# EAGLE design STATION_1608_v1 (EAGLE 9.4.2)
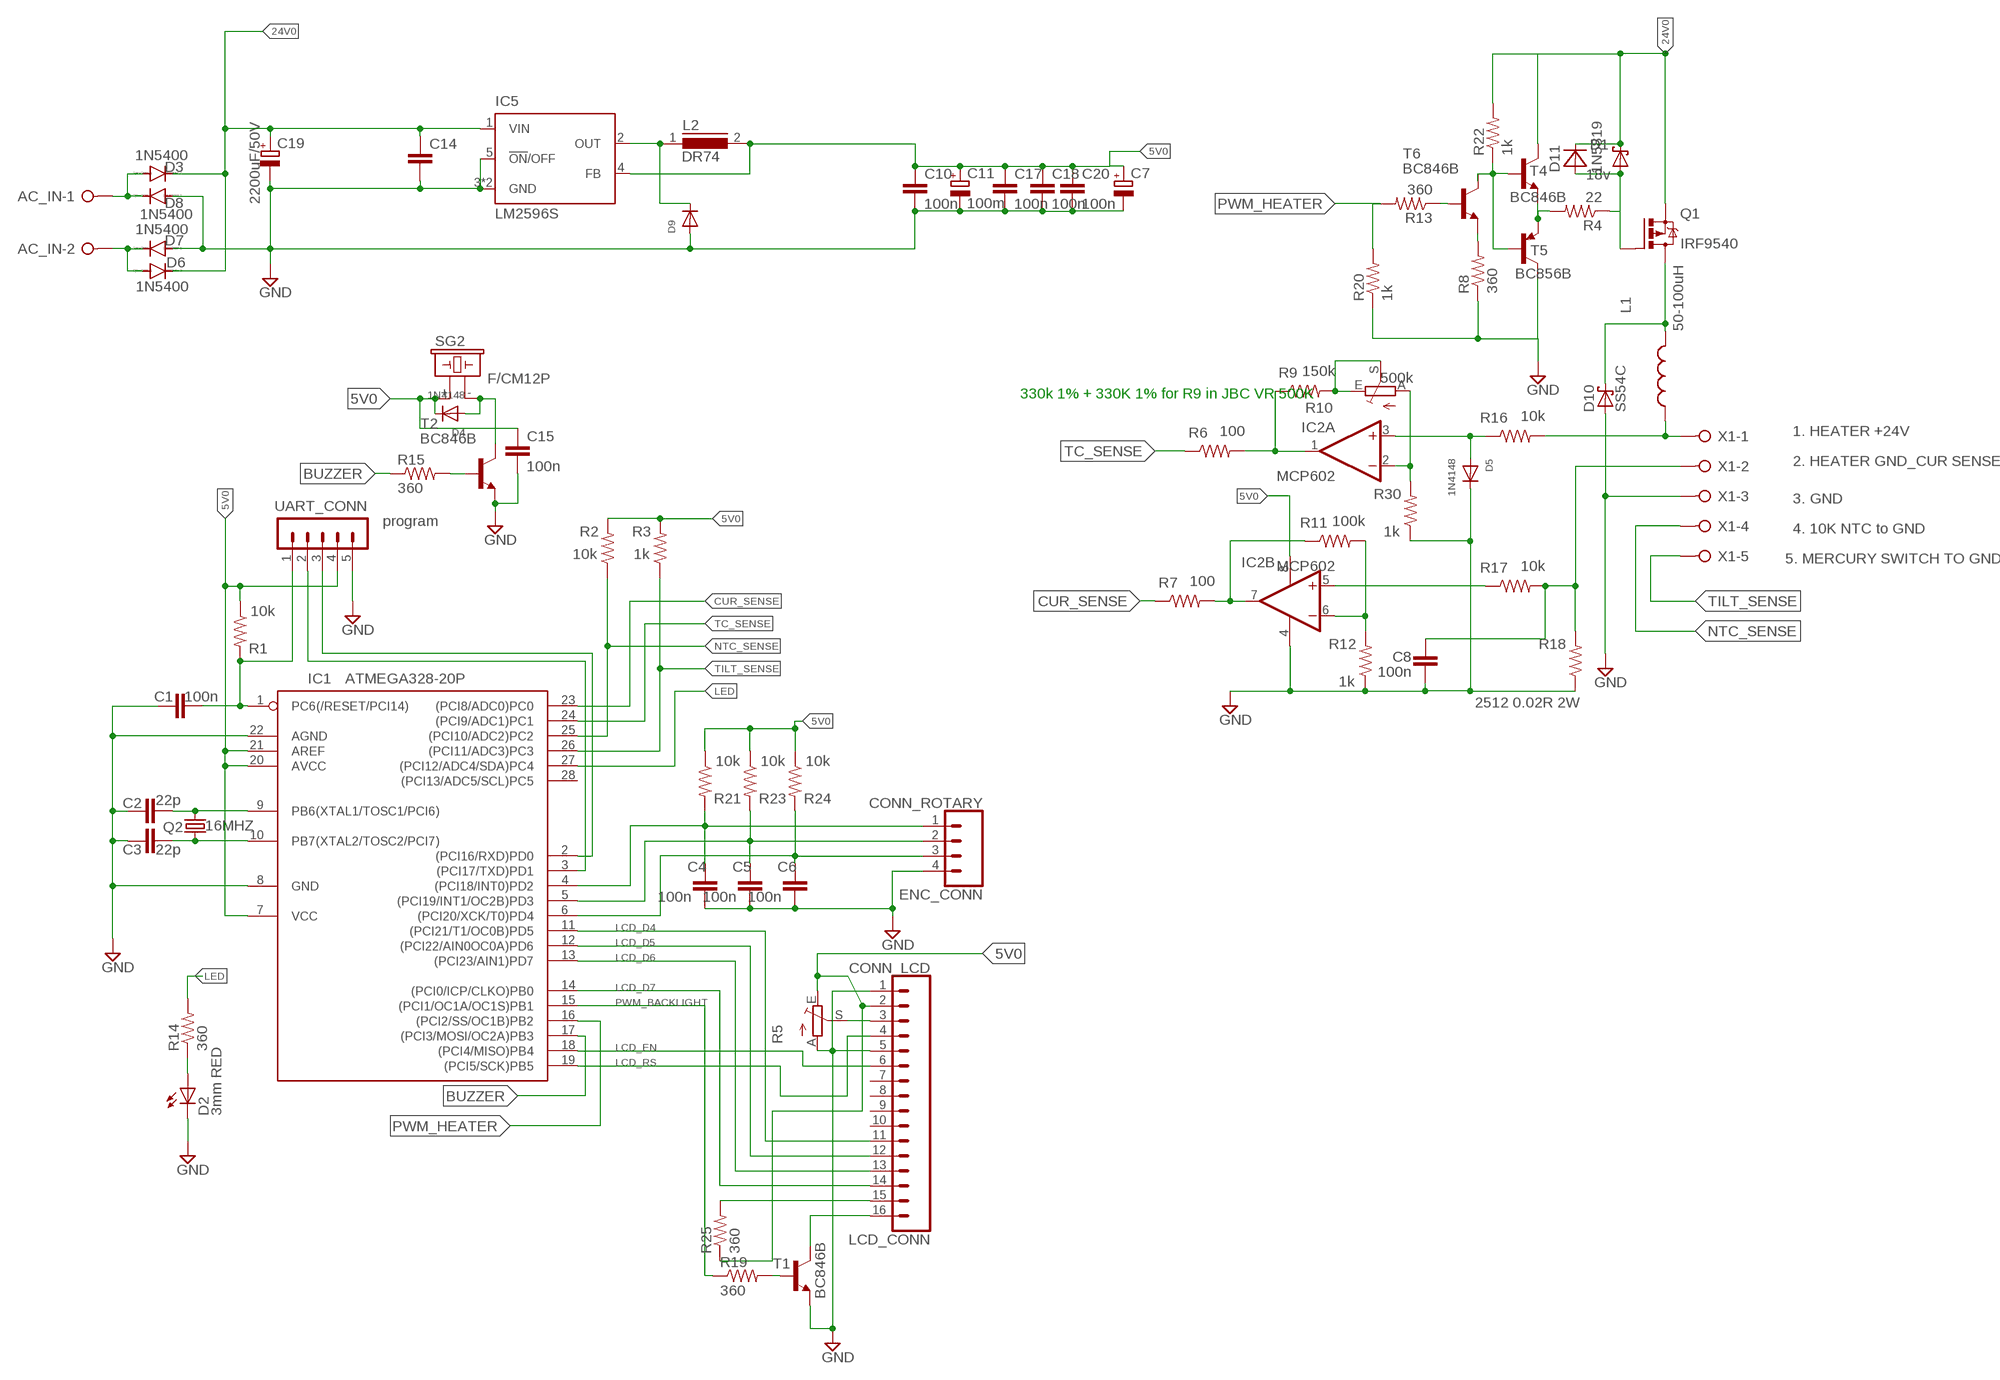
[diagram p0: schematic, sheet 1]

## Parts
AC_IN  W237-02P  [W237-132]
C1  100n  C-EUC0805  [C0805]
C2  22p  C-EUC0805  [C0805]
C3  22p  C-EUC0805  [C0805]
C4  100n  C-EUC0805  [C0805]
C5  100n  C-EUC0805  [C0805]
C6  100n  C-EUC0805  [C0805]
C7  CPOL-EUE3.5-8  [E3,5-8]
C8  100n  C-EUC0805  [C0805]
C10  100n  C-EUC0805  [C0805]
C11  100m  CPOL-EUE3.5-8  [E3,5-8]
C14  100n  C-EUC0805  [C0805]
C15  100n  C-EUC0805K  [C0805K]
C17  100n  C-EUC0805  [C0805]
C18  100n  C-EUC0805  [C0805]
C19  2200uF/50V  CPOL-EUE7.5-16  [E7,5-16]
C20  100n  C-EUC0805  [C0805]
D1  18v  BAS85  [SOD80C]
D2  3mm RED  LED5MM  [LED5MM]
D3  1N5400  [DO201-15]
D4  1N4148  DIODESOD-123  [SOD-123]
D5  1N4148  DIODESOD-123  [SOD-123]
D6  1N5400  [DO201-15]
D7  1N5400  [DO201-15]
D8  1N5400  [DO201-15]
D9  DIODESMA  [SMADIODE]
D10  SS54C  MBRS320T3  [SMC]
D11  1N5819  MBRA340T3  [SMA]
ENC_CONN  CONN_ROTARY  CONN_04LONGPADS  [1X04_LONGPADS]
IC1  ATMEGA328-20P  [DIL28-3]
IC2  MCP602  MCP602P  [DIL08]
IC5  LM2596S  [TO263-5]
L1  50-100uH  L-USIRF-46  [IRF46]
L2  DR74  [DR74]
LCD_CONN  CONN_LCD  CONN_16LONGPADS  [1X16_LONGPADS]
Q1  IRF9540  IRF4905FG  [TO220BV]
Q2  16MHZ  CRYSTALHC49S  [HC49/S]
R1  10k  R-US_M0805  [M0805]
R2  10k  R-US_M0805  [M0805]
R3  1k  R-US_M0805  [M0805]
R4  22  R-US_M0805  [M0805]
R5  TRIM_EU-RJ9W  [RJ9W]
R6  100  R-US_M0805  [M0805]
R7  100  R-US_M0805  [M0805]
R8  360  R-US_M0805  [M0805]
R9  150k  R-US_M0805  [M0805]
R10  500k  TRIM_EU-RJ9W  [RJ9W]
R11  100k  R-US_M0805  [M0805]
R12  1k  R-US_M0805  [M0805]
R13  360  R-US_M0805  [M0805]
R14  360  R-US_M0805  [M0805]
R15  360  R-US_M0805  [M0805]
R16  10k  R-US_M0805  [M0805]
R17  10k  R-US_M0805  [M0805]
R18  2512 0.02R 2W  R-US_R2512  [R2512]
R19  360  R-US_M0805  [M0805]
R20  1k  R-US_M0805  [M0805]
R21  10k  R-US_M0805  [M0805]
R22  1k  R-US_M0805  [M0805]
R23  10k  R-US_M0805  [M0805]
R24  10k  R-US_M0805  [M0805]
R25  360  R-US_M0805  [M0805]
R30  1k  R-US_M0805  [M0805]
SG2  F/CM12P  [F/CM12P]
T1  BC846B  BC846B-NPN-SOT23-BEC  [SOT23-BEC]
T2  BC846B  BC846B-NPN-SOT23-BEC  [SOT23-BEC]
T4  BC846B  BC846B-NPN-SOT23-BEC  [SOT23-BEC]
T5  BC856B  BC856B-PNP-SOT23-BEC  [SOT23-BEC]
T6  BC846B  BC846B-NPN-SOT23-BEC  [SOT23-BEC]
UART_CONN  program  MA05-1  [MA05-1]
X1  W237-05P  [W237-5P]

## Nets
5V0: C7.+ C10.1 C11.+ C15.1 C17.1 C18.1 C20.1 D4.C IC1.7(VCC) IC1.20(AVCC) IC1.21(AREF) IC2.8(P:V+) IC5.4(FB) L2.2 LCD_CONN.2 R1.1 R2.2 R3.2 R5.E R21.1 R23.1 R24.1 R25.1 SG2.+ UART_CONN.4
24V0: C14.1 C19.+ D1.1(K) D3.C D6.C D11.C IC5.1(VIN) Q1.S R22.2 T4.C
BUZZER: IC1.17((PCI3/MOSI/OC2A)PB3) R15.1
CUR_SENSE: IC1.23((PCI8/ADC0)PC0) R7.1
GND: C1.1 C2.1 C3.1 C4.2 C5.2 C6.2 C7.- C8.2 C10.2 C11.- C14.2 C15.2 C17.2 C18.2 C19.- C20.2 D2.K(C) D5.C D7.A D8.A D9.A D10.A ENC_CONN.4 IC1.8(GND) IC1.22(AGND) IC2.4(P:V-) IC5.3(GND) IC5.5(!ON!/OFF) IC5.6(GND) LCD_CONN.1 LCD_CONN.5 R5.A R8.1 R12.1 R18.1 R20.1 R30.1 T1.E T2.E T5.C UART_CONN.5 X1.3
LCD_D4: IC1.11((PCI21/T1/OC0B)PD5) LCD_CONN.11
LCD_D5: IC1.12((PCI22/AIN0OC0A)PD6) LCD_CONN.12
LCD_D6: IC1.13((PCI23/AIN1)PD7) LCD_CONN.13
LCD_D7: IC1.14((PCI0/ICP/CLKO)PB0) LCD_CONN.14
LCD_EN: IC1.18((PCI4/MISO)PB4) LCD_CONN.6
LCD_RS: IC1.19((PCI5/SCK)PB5) LCD_CONN.4
LED: IC1.27((PCI12/ADC4/SDA)PC4) R14.2
MOSFET_GATE: D1.2(A) D11.A Q1.G R4.1
N$1: C2.2 IC1.9(PB6(XTAL1/TOSC1/PCI6)) Q2.2
N$2: C3.2 IC1.10(PB7(XTAL2/TOSC2/PCI7)) Q2.1
N$3: C4.1 ENC_CONN.1 IC1.4((PCI18/INT0)PD2) R21.2
N$4: R4.2 T4.E T5.E
N$5: C5.1 ENC_CONN.2 IC1.5((PCI19/INT1/OC2B)PD3) R23.2
N$6: D9.C IC5.2(OUT) L2.1
N$7: IC1.3((PCI17/TXD)PD1) UART_CONN.2
N$8: IC1.2((PCI16/RXD)PD0) UART_CONN.3
N$9: C6.1 ENC_CONN.3 IC1.6((PCI20/XCK/T0)PD4) R24.2
N$10: AC_IN.2 D6.A D7.C
N$11: AC_IN.1 D3.A D8.C
N$12: LCD_CONN.3 R5.S
N$14: LCD_CONN.16 T1.C
N$15: LCD_CONN.15 R25.2
N$16: R15.2 T2.B
N$18: IC2.7(B:OUT) R7.2 R11.1
N$19: R13.1 T6.B
N$20: IC2.6(B:-IN) R11.2 R12.2
N$22: R22.1 T4.B T5.B T6.C
N$23: IC2.5(B:+IN) R17.1
N$25: R9.2 R10.E R10.S
N$26: IC2.2(A:-IN) R10.A R30.2
N$27: IC2.1(A:OUT) R6.2 R9.1
N$28: D5.A IC2.3(A:+IN) R16.1
N$29: R8.2 T6.E
N$30: C1.2 IC1.1(PC6(/RESET/PCI14)) R1.2 UART_CONN.1
N$31: L1.1 R16.2 X1.1
N$32: D10.C L1.2 Q1.D
N$34: D4.A SG2.- T2.C
N$35: R19.2 T1.B
N$37: D2.A R14.1
N$40: C8.1 R17.2 R18.2 X1.2
NTC_SENSE: IC1.25((PCI10/ADC2)PC2) R2.1 X1.4
PWM_BACKLIGHT: IC1.15((PCI1/OC1A/OC1S)PB1) R19.1
PWM_HEATER: IC1.16((PCI2/SS/OC1B)PB2) R13.2 R20.2
TC_SENSE: IC1.24((PCI9/ADC1)PC1) R6.1
TILT_SENSE: IC1.26((PCI11/ADC3)PC3) R3.1 X1.5
Unconnected: IC1.28((PCI13/ADC5/SCL)PC5) LCD_CONN.7 LCD_CONN.8 LCD_CONN.9 LCD_CONN.10

## Notes on the sheet
- 330k 1% + 330K 1% for R9 in JBC VR 500K
- 1. HEATER +24V
- 2. HEATER GND_CUR SENSE
- 3. GND
- 4. 10K NTC to GND
- 5. MERCURY SWITCH TO GND

## Library data of the parts
AC_IN = con-wago-508:W237-02P: WAGO SREW CLAMP; OC_FARNELL: unknown; OC_NEWARK: unknown
C1-C6 C8 C15 = rcl:C-EU: CAPACITOR, European symbol; SPICEPREFIX: C
C7 C11 C19 = rcl:CPOL-EU: POLARIZED CAPACITOR, European symbol; SPICEPREFIX: C
C10 C14 C17 C18 C20 = resistor:C-EU: CAPACITOR, European symbol; COMET: 16789
D1 = nxp_60:BAS85: Schottky barrier diode Planar Schottky barrier diode with an integrated guard ring for stress protection, encapsulated in a small hermetically sealed glass SOD80C Surface-Mounted Device SMD package with tin-plated metal discs at each end. It is suitable for ?automatic placement? and as such it can withstand immersion soldering. AAL Eindhoven MK
D2 = adafruit:LED: LED OSRAM: - CHIPLED LG R971, LG N971, LY N971, LG Q971, LY Q971, LO R971, LY R971 LH N974, LH R974 LS Q976, LO Q976, LY Q976 LO Q996 - Hyper CHIPLED LW Q18S LB Q993, LB Q99A, LB R99A - SideLED LS A670, LO A670, LY A670, LG A670, LP A670 LB A673, LV A673, LT A673, LW A673 LH A674 LY A675 LS A676, LA A676, LO A676, LY A676, LW A676 LS A679, LY A679, LG A679 - Hyper Micro SIDELED® LS Y876, LA Y876, LO Y876, LY Y876 LT Y87S - SmartLED LW L88C, LW L88S LB L89C, LB L89S, LG L890 LS L89K, LO L89K, LY L89K LS L896, LA L896, LO L896, LY L896 - TOPLED LS T670, LO T670, LY T670, LG T670, LP T670 LSG T670, LSP T670, LSY T670, LOP T670, LYG T670 LG T671, LOG T671, LSG T671 LB T673, LV T673, LT T673, LW T673 LH T674 LS T676, LA T676, LO T676, LY T676, LB T676, LH T676, LSB T676, LW T676 LB T67C, LV T67C, LT T67C, LS T67K, LO T67K, LY T67K, LW E67C LS E67B, LA E67B, LO E67B, LY E67B, LB E67C, LV E67C, LT E67C LW T67C LS T679, LY T679, LG T679 LS T770, LO T770, LY T770, LG T770, LP T770 LB T773, LV T773, LT T773, LW T773 LH T774 LS E675, LA E675, LY E675, LS T675 LS T776, LA T776, LO T776, LY T776, LB T776 LHGB T686 LT T68C, LB T68C - Hyper Mini TOPLED® LB M676 - Mini TOPLED Santana® LG M470 LS M47K, LO M47K, LY M47K Source: http://www.osram.convergy.de/
D3 D6-D8 = diode:1N5400: DIODE standard rectifier, 3 A, 50 V (Motorola)
D4 D5 D9 = adafruit:DIODE: Diode SMADIODE - SMA Surface Mount Package 20V 1A Schottky Diode Digikey: 641-1014-6-ND DO-1N4148 - Through Hole Small Current Diode SOD-123 20V 1 A (.5mV Vf) Schottky Diode - Digikey: MBRX120TPMSCT-ND SOD-323 10V 570mA (.38mV Vf, 3ns) Schottky Diode - Digikey: ZLLS410CT-ND SOD-523 30V 30mA Schottky Diode (RB751S-40TE61) - Digikey: RB751S-40TE61CT-ND SOT23-R/W - SOT23 Package (R = Solder Paste/Reflow Ovens, W = Hand-Soldering) BAT54Film 40V 300mA - Digikey: 497-7162-1-ND
D10 = diode:MBRS3*0T3: SCHOTTKY BARRIER RECTIFIER 3.0 AMPERES 20, 30, 40 VOLT Source: MBRS340T3-D.pdf
D11 = diode:MBRA340T3: Surface Mount Schottky Power Rectifier Source: http://www.onsemi.com/pub_link/Collateral/MBRA340T3-D.PDF
ENC_CONN = SparkFun-Connectors:CONN_04: Multi connection point. Often used as Generic Header-pin footprint for 0.1 inch spaced/style header connections On any of the 0.1 inch spaced packages, you can populate with these: Break Away Headers - Straight <https://www.sparkfun.com/products/116> (PRT-00116) Break Away Male Headers - Right Angle <https://www.sparkfun.com/products/553> (PRT-00553) Female Headers <https://www.sparkfun.com/products/115> (PRT-00115) Break Away Headers - Machine Pin <https://www.sparkfun.com/products/117> (PRT-00117) Break Away Female Headers - Swiss Machine Pin <https://www.sparkfun.com/products/743> (PRT-00743) For SCREWTERMINALS and SPRING TERMINALS visit here: Screw Terimnals on SparkFun.com <https://www.sparkfun.com/search/results?term=Screw+Terminals> (5mm/3.5mm/2.54mm spacing) This device is also useful as a general connection point to wire up your design to another part of your project. Our various solder wires solder well into these plated through hole pads. Hook-Up Wire - Assortment (Stranded, 22 AWG) <https://www.sparkfun.com/products/11375> (PRT-11375) Hook-Up Wire - Assortment (Solid Core, 22 AWG) <https://www.sparkfun.com/products/11367> (PRT-11367) View the entire wire category on our website here <https://www.sparkfun.com/categories/141> Special notes: Molex polarized connector foot print use with SKU : PRT-08231 with associated crimp pins and housings. 1MM SMD Version SKU: PRT-10208; PROD_ID: CONN-09696
IC1 = atmega328:ATMEGA328*P: MICROCONTROLLER 32 kBytes FLASH 2 kBytes SRAM 1 kBytes EEPROM USART 8-channel 10 bit ADC
IC2 = linear:MCP602: Single Op Amp 2.7V to 6.0V Single Supply CMOS Source: http://ww1.microchip.com/downloads/en/DeviceDoc/21314g.pdf
IC5 = national-semiconductor:LM2596: SIMPLE SWITCHER® Power Converter 150 kHz 3A Step-Down Voltage Regulator Source: http://www.national.com/ds/LM/LM2596.pdf; MF: NATIONAL SEMICONDUCTOR; MPN: LM2596S-ADJ/NOPB; OC_FARNELL: 9494367; OC_NEWARK: 41K3842
L1 = rcl:L-US: INDUCTOR, American symbol; SPICEPREFIX: L
L2 = inductors:DR74: High Power Density, High Efficiency, Shielded Inductors Source: coiltronics_dr_series.pdf; COMET: 45279; SPICEPREFIX: L
LCD_CONN = SparkFun-Connectors:CONN_16: Multi connection point. Often used as Generic Header-pin footprint for 0.1 inch spaced/style header connections On any of the 0.1 inch spaced packages, you can populate with these: Break Away Headers - Straight <https://www.sparkfun.com/products/116> (PRT-00116) Break Away Male Headers - Right Angle <https://www.sparkfun.com/products/553> (PRT-00553) Female Headers <https://www.sparkfun.com/products/115> (PRT-00115) Break Away Headers - Machine Pin <https://www.sparkfun.com/products/117> (PRT-00117) Break Away Female Headers - Swiss Machine Pin <https://www.sparkfun.com/products/743> (PRT-00743) For SCREWTERMINALS and SPRING TERMINALS visit here: Screw Terimnals on SparkFun.com <https://www.sparkfun.com/search/results?term=Screw+Terminals> (5mm/3.5mm/2.54mm spacing) This device is also useful as a general connection point to wire up your design to another part of your project. Our various solder wires solder well into these plated through hole pads. Hook-Up Wire - Assortment (Stranded, 22 AWG) <https://www.sparkfun.com/products/11375> (PRT-11375) Hook-Up Wire - Assortment (Solid Core, 22 AWG) <https://www.sparkfun.com/products/11367> (PRT-11367) View the entire wire category on our website here <https://www.sparkfun.com/categories/141> Special notes: Molex polarized connector foot print use with SKU : PRT-08231 with associated crimp pins and housings. 1MM SMD Version SKU: PRT-10208 NOTES ON THE VARIANTS LOCK and LOCK_LONGPADS... This footprint was designed to help hold the alignment of a through-hole component (i.e. 6-pin header) while soldering it into place. You may notice that each hole has been shifted either up or down by 0.005 of an inch from it's more standard position (which is a perfectly straight line). This slight alteration caused the pins (the squares in the middle) to touch the edges of the holes. Because they are alternating, it causes a "brace" to hold the component in place. 0.005 has proven to be the perfect amount of "off-center" position when using our standard breakaway headers. Although looks a little odd when you look at the bare footprint, once you have a header in there, the alteration is very hard to notice. Also,if you push a header all the way into place, it is covered up entirely on the bottom side.
Q1 = transistor-power:IRF4905: P-Channel HEXFET® Power MOSFET RDS(on)= 0.02 Ohm, ID = -74A Source: http://www.irf.com/product-info/datasheets/data/irf4905pbf.pdf
Q2 = crystal:CRYSTAL: CRYSTAL; OC_FARNELL: 1667008; OC_NEWARK: unknown
R1-R4 R6-R9 R11-R17 R19-R25 R30 = rcl:R-US_: RESISTOR, American symbol; SPICEPREFIX: R
R5 R10 = pot:TRIM_EU-: POTENTIOMETER
R18 = rcl:R-US_: RESISTOR, American symbol; COMET: 35370; SPICEPREFIX: R
SG2 = buzzer:F/CM12P: BUZZER Source: Buerklin; OC_FARNELL: unknown; OC_NEWARK: unknown
T1 T2 T4 T6 = transistor:*-NPN-: NPN Transistror BF959 corrected 2008.03.06
T5 = transistor:*-PNP-: PNP Transistror
UART_CONN = con-lstb:MA05-1: PIN HEADER; OC_FARNELL: unknown; OC_NEWARK: unknown
X1 = con-wago-508:W237-05P: WAGO SREW CLAMP; OC_FARNELL: unknown; OC_NEWARK: unknown

## Board
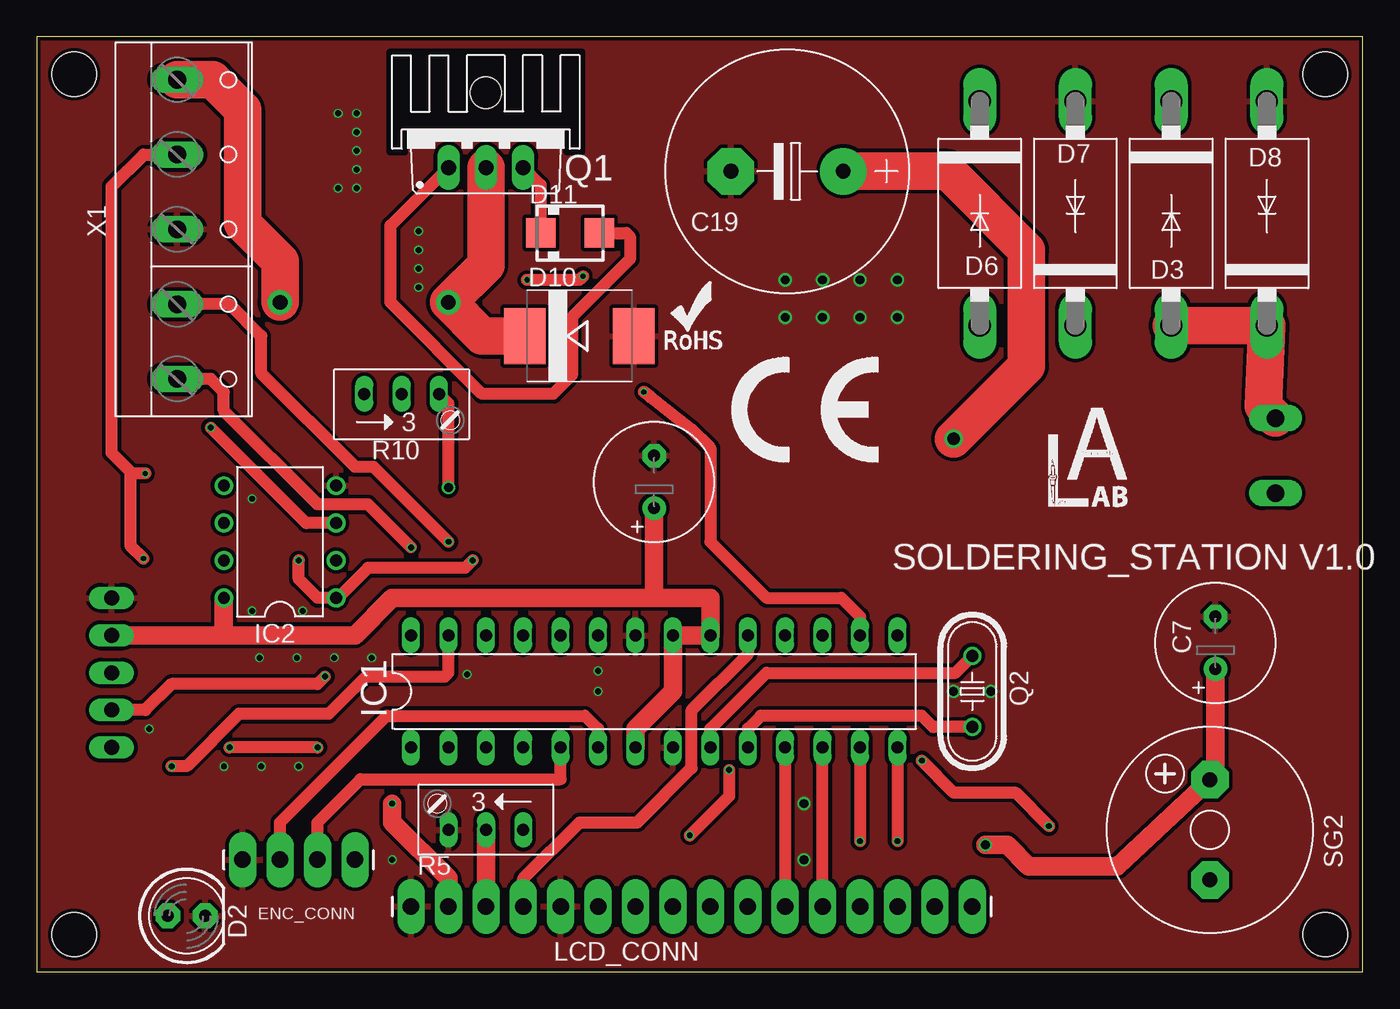
[diagram p1: board, top side]
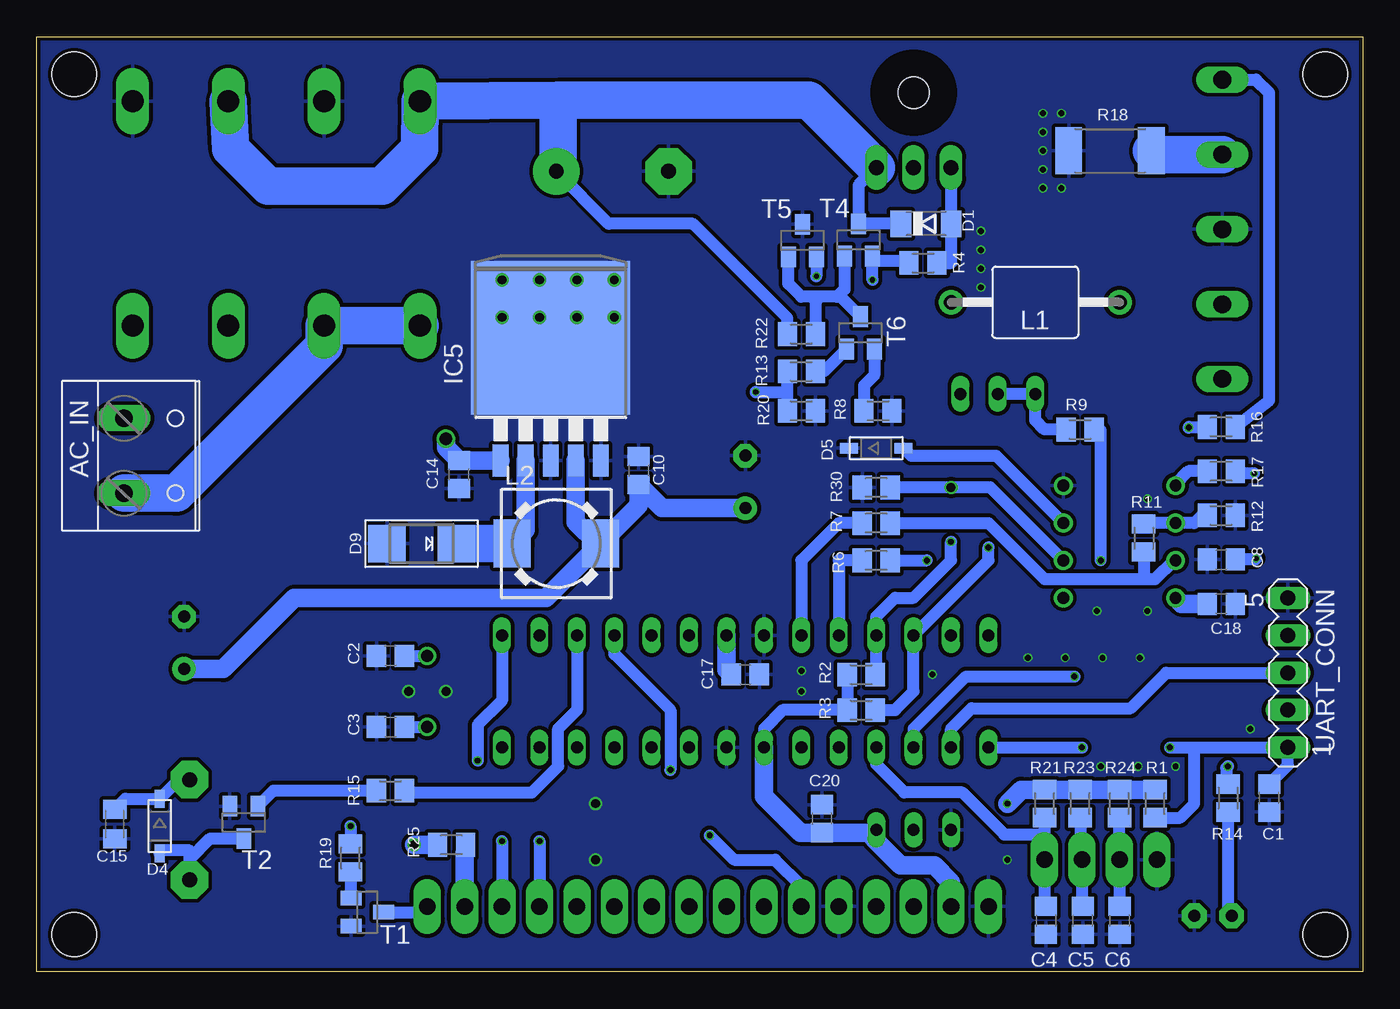
[diagram p2: board, bottom side, seen from below]

Size 90 x 63.49 mm. Coordinates in mm from the lower left corner, seen from the top.
Outline: 0,0 90,0 90,63.49 0,63.49 0,0
Copper layers (1*16): Top 0.035559375mm / dielectric 1.6mm / Bottom 0.035559375mm
Design rules "jlcpcb2layer": minimum track width 5mil, minimum drill 12mil, track to track 5mil, track to pad 5mil, pad to pad 5mil, via to via 5mil, smd to smd 5mil, copper to edge 8mil, drill to drill 6mil, minimum pad ring 5mil, minimum via ring 3mil, stop-mask expansion 2.5mil, vias tented up to drill 0mil, thermal gap 10mil
Holes 3 mm at 2.54,2.54 87.46,2.54 2.54,60.95 87.46,60.95

### Footprints (pad centres in the part's own frame; a part is rotated, then mirrored left to right if it is on the bottom)
W237-132 = drill 1.194 long: 1 -2.54,-0.635; 2 2.54,-0.635
C0805 = smd 1.3 x 1.5: 1 -0.95,0; 2 0.95,0
E3,5-8 = drill 0.813 pad 1.6: + -1.778,0 | drill 0.813 pad 1.6 octagon: - 1.778,0
C0805K = smd 1.3 x 1.6: 1 -1,0; 2 1,0
E7,5-16 = drill 1.016 pad 3.15: + -3.81,0 | drill 1.016 pad 3.15 octagon: - 3.81,0
SOD80C = smd 1.4 x 1.8: 1 -1.7,0; 2 1.7,0
LED5MM = drill 0.813 pad 1.676 octagon: A -1.27,0; K 1.27,0
DO201-15 = drill 1.499 long: A 7.62,0; C -7.62,0
SOD-123 = smd 1.2 x 0.7: A 1.85,0; C -1.85,0
SMADIODE = smd 2.54 x 2.54: A 2.349,0; C -2.349,0
SMC = smd 2.8 x 3.8: A 3.7,0; C -3.7,0
SMA = smd 2 x 2: A 2,0; C -2,0
1X04_LONGPADS = drill 1.118 pad 1.88 long: 1 0,0; 2 2.54,0; 3 5.08,0; 4 7.62,0
DIL28-3 = drill 0.813 long: 1 -16.51,-3.81; 2 -13.97,-3.81; 3 -11.43,-3.81; 4 -8.89,-3.81; 5 -6.35,-3.81; 6 -3.81,-3.81; 7 -1.27,-3.81; 8 1.27,-3.81; 9 3.81,-3.81; 10 6.35,-3.81; 11 8.89,-3.81; 12 11.43,-3.81; 13 13.97,-3.81; 14 16.51,-3.81; 15 16.51,3.81; 16 13.97,3.81; 17 11.43,3.81; 18 8.89,3.81; 19 6.35,3.81; 20 3.81,3.81; 21 1.27,3.81; 22 -1.27,3.81; 23 -3.81,3.81; 24 -6.35,3.81; 25 -8.89,3.81; 26 -11.43,3.81; 27 -13.97,3.81; 28 -16.51,3.81
DIL08 = drill 0.813 pad 1.27: 1 -3.81,-3.81; 2 -1.27,-3.81; 3 1.27,-3.81; 4 3.81,-3.81; 5 3.81,3.81; 6 1.27,3.81; 7 -1.27,3.81; 8 -3.81,3.81
TO263-5 = smd 1.067 x 2.159: 1 -3.404,-5.791; 2 -1.702,-5.791; 3 0,-5.791; 4 1.702,-5.791; 5 3.404,-5.791 | smd 10.8 x 10.41: 6 0,2.54
IRF46 = drill 1 pad 1.676: 1 -5.715,0; 2 5.715,0
DR74 = smd 2.5 x 3.25: 1 -3,0; 2 3,0
1X16_LONGPADS = drill 1.118 pad 1.88 long: 1 0,0; 2 2.54,0; 3 5.08,0; 4 7.62,0; 5 10.16,0; 6 12.7,0; 7 15.24,0; 8 17.78,0; 9 20.32,0; 10 22.86,0; 11 25.4,0; 12 27.94,0; 13 30.48,0; 14 33.02,0; 15 35.56,0; 16 38.1,0
TO220BV = drill 1.016 long: D 0,-2.54; G -2.54,-2.54; S 2.54,-2.54
HC49/S = drill 0.813: 1 -2.413,0; 2 2.413,0
M0805 = smd 1.3 x 1.6: 1 -0.95,0; 2 0.95,0
RJ9W = drill 0.813 long: A 2.54,0.635; E -2.54,0.635; S 0,0.635
R2512 = smd 1.8 x 3.2: 1 -2.8,0; 2 2.8,0
F/CM12P = drill 1.016 pad 2.54 octagon: + 3.4,0; - -3.4,0
SOT23-BEC = smd 1 x 1.4: B -0.95,-1.1; C 0,1.1; E 0.95,-1.1
SK-95 = hole 2.134: 0,0
MA05-1 = drill 1.016 long: 1 -5.08,0; 2 -2.54,0; 3 0,0; 4 2.54,0; 5 5.08,0
W237-5P = drill 1.194 long: 1 -10.16,-0.635; 2 -5.08,-0.635; 3 0,-0.635; 4 5.08,-0.635; 5 10.16,-0.635

### Placement (x,y rotation side)
AC_IN  83.44,35.05 270 bottom
C1  6.35,11.81 90 bottom
C2  66,21.46 0 bottom
C3  66,16.64 0 bottom
C4  21.5,3.5 270 bottom
C5  19,3.5 270 bottom
C6  16.5,3.5 270 bottom
C7  80.01,22.35 90 top
C8  9.6,28 180 bottom
C10  49.15,34.04 90 bottom
C11  41.91,33.27 90 top
C14  61.34,33.78 270 bottom
C15  84.71,10.03 270 bottom
C17  41.91,20.19 0 bottom
C18  9.6,25 0 bottom
C19  50.93,54.36 180 top
C20  36.7,10.41 90 bottom
D1  29.64,50.8 0 bottom
D2  10.16,3.81 0 top
D3  77,51.5 270 top
D4  81.66,9.91 270 bottom
D5  33.02,35.56 0 bottom
D6  64,51.5 270 top
D7  70.5,51.5 90 top
D8  83.5,51.5 90 top
D9  63.88,29.08 180 bottom
D10  36.83,43.18 0 top
D11  36.2,50.16 0 top
ENC_CONN  21.59,7.62 180 top
IC1  41.91,19.05 0 top
IC2  16.51,29.21 90 top
IC5  55.12,40.51 0 bottom
L1  22.23,45.47 180 bottom
L2  54.74,29.08 0 bottom
LCD_CONN  25.4,4.45 0 top
Q1  30.48,57.15 0 top
Q2  63.5,19.05 90 top
R1  14.1,11.43 270 bottom
R2  34.04,20.19 180 bottom
R3  34.04,17.78 180 bottom
R4  29.84,48.13 180 bottom
R5  30.48,10.29 180 top
R6  33.02,27.94 0 bottom
R7  33.02,30.48 0 bottom
R8  32.89,38.1 180 bottom
R9  19.18,36.83 180 bottom
R10  24.77,38.61 0 top
R11  14.86,29.46 90 bottom
R12  9.6,31 180 bottom
R13  38.1,40.77 180 bottom
R14  9.14,11.81 90 bottom
R15  66,12.32 180 bottom
R16  9.6,37 0 bottom
R17  9.6,34 0 bottom
R18  2512 0.15R HAKKO 0.002 JBC  [R2512]  17.14,55.75 0 bottom
R19  68.71,7.75 270 bottom
R20  38.1,38.1 180 bottom
R21  21.59,11.43 270 bottom
R22  38.1,43.31 180 bottom
R23  19.18,11.43 270 bottom
R24  16.51,11.43 270 bottom
R25  61.85,8.64 0 bottom
R30  33.02,32.89 0 bottom
SG2  79.63,9.65 90 top
T1  67.56,4.06 270 bottom
T2  75.95,10.16 180 bottom
T4  34.22,49.7 0 bottom
T5  38.03,49.66 0 bottom
T6  34.1,43.4 0 bottom
U$1  [SK-95]  30.48,59.69 0 top
U$2  [ALAB_LOGO]  71.12,34.29 0 top
U$3  [ROHS_LOGO_0.18_IN]  42.42,42.16 0 top
U$4  [CE_7.3MM]  47.12,34.54 0 top
UART_CONN  5.08,20.32 90 bottom
X1  10.16,50.42 270 top

### Tracks (layer width: path | path; a pad name or v marks a point on that pad's centre or on a via)
5V0  (via drill 0.4, 0.6)
  Top 1.27: v24.13,11.43 24.13,10.16 27.94,6.35 LCD_CONN.2 | 41.91,25.4 45.72,25.4 IC1.20 IC1.21 43.18,19.05 40.64,16.51 IC1.7 | 41.91,25.4 24.13,25.4 21.59,22.86 12.7,22.86 | 12.7,22.86 UART_CONN.4 | IC2.8 12.7,22.86 | C11.+ 41.91,25.4 | v64.39,8.64 65.88,8.64 67.32,7.19 73.36,7.19 SG2.+ 80.01,13.84 C7.+
  Bottom 0.813: R2.2 R3.2 39.37,17.78 40.64,16.51 IC1.7 | SG2.+ 79.95,13.46 D4.C 83.99,11.76 C15.1
  Bottom 1.27: LCD_CONN.2 27.94,6.1 29.08,7.24 31.37,7.24 33.21,9.08 33.21,9.46 | v24.13,11.43 23.18,12.38 R21.1 R23.1 R24.1 R1.1 | IC2.8 12.3,25 C18.1 | IC1.7 40.64,11.94 38.17,9.46 C20.1 33.21,9.46 | 33.21,9.46 R5.E | L2.2 49.15,31.67 C10.1 47.56,31.5 C11.+ | IC5.4 53.42,30.56 51.94,29.08 L2.2 | C17.1 43.18,20.51 IC1.21 | R25.1 v64.39,8.64 | L2.2 55.42,25.4 72.52,25.4 77.34,20.57 C7.+
24V0  (via drill 0.85)
  Top 0.813: Q1.S 34.2,53.44 D11.C
  Top 2.54: v62.23,36.2 67.18,41.15 67.18,49.02 61.85,54.36 C19.+
  Bottom 0.813: D1.1 T4.C 34.22,53.41 Q1.S | R22.2 39.05,44.38 45.47,50.8 51.18,50.8 C19.+
  Bottom 1.27: IC5.1 C14.1 62.23,35.62 v62.23,36.2
  Bottom 2.54: D3.C 76.83,55.88 74.3,53.34 66.55,53.34 64.01,55.88 D6.C 54.61,59.18 | Q1.S 37.59,59.18 54.61,59.18 | C19.+ 54.61,54.48 54.61,59.18
BUZZER
  Bottom 0.813: IC1.17 53.34,17.78 54.61,16.51 54.61,13.97 56.39,12.19 65.09,12.19 R15.1
CUR_SENSE
  Bottom 0.813: R7.1 35.56,30.48 38.1,27.94 IC1.23
GND  (via drill 0.4, 0.6)
  other vias: 14.61,24.51 18.03,24.51 24.13,7.62 38.1,20.45 29.21,20.19 38.1,19.05 7.62,16.51 20.19,21.34 22.73,21.34 17.65,21.34 15.11,21.34 17.78,13.97 15.24,13.97 12.7,13.97 50.8,46.99 58.42,46.99 58.42,44.45 55.88,44.45 55.88,46.99 53.34,46.99 53.34,44.45 50.8,44.45 20.45,58.29 21.72,58.29 21.72,57.02 21.72,55.75 21.72,54.48 21.72,53.21 20.45,53.21 14.61,32.13 52.07,11.43 52.07,7.62 64.77,19.05 62.23,19.05 25.91,50.29 25.91,49.02 25.91,47.75 25.91,46.48
  pour Bottom (isolate 0.254): -11.43,-2.54 -11.43,67.31 100.33,67.31 100.33,-2.54
  pour Top (isolate 0.254): -6.35,-3.81 -6.35,67.31 96.52,67.31 96.52,-3.81
  pour Bottom (no thermals): 48.26,49.53 62.23,49.53 62.23,38.1 60.96,36.83 48.26,36.83
LCD_D4
  Top 0.813: IC1.11 LCD_CONN.11
LCD_D5
  Top 0.813: LCD_CONN.12 IC1.12
LCD_D6  (via drill 0.4)
  Top 0.813: IC1.13 v55.88,8.89
  Bottom 0.813: v55.88,8.89 LCD_CONN.13
LCD_D7  (via drill 0.4)
  Top 0.813: IC1.14 v58.42,8.89
  Bottom 0.813: v58.42,8.89 LCD_CONN.14
LCD_EN  (via drill 0.4)
  Top 0.813: v44.32,9.27 46.99,11.94 v46.99,13.72
  Bottom 0.813: v46.99,13.72 46.99,17.78 50.8,21.59 IC1.18 | v44.32,9.27 42.67,7.62 39.88,7.62 38.1,5.84 LCD_CONN.6
LCD_RS
  Top 0.813: IC1.19 48.26,21.59 44.45,17.78 44.45,13.84 40.77,10.16 36.83,10.16 33.02,6.35 LCD_CONN.4
LED  (via drill 0.4)
  Top 0.813: IC1.27 27.94,20.32 27.69,20.07 22.35,20.07 19.81,17.53 13.72,17.53 10.16,13.97 v9.14,13.97
  Bottom 0.813: v9.14,13.97 9.27,13.84 9.27,12.89 R14.2
MOSFET_GATE
  Top 0.813: D11.A 40.01,50.16 40.26,49.91 40.26,48.39 36.32,44.45 36.32,40.51 35.05,39.24 30.23,39.24 24,45.47 24,50.67 Q1.G
  Bottom 0.813: R4.1 27.94,48.13 D1.2 Q1.G
N$1
  Top 0.813: IC1.9 45.72,16.51 49.53,20.32 62.36,20.32 Q2.2
  Bottom 0.813: C2.2 Q2.2
N$2
  Top 0.813: Q2.1 60.83,16.64 60.07,17.4 49.15,17.4 48.26,16.51 IC1.10
  Bottom 0.813: C3.2 Q2.1
N$3
  Bottom 0.813: IC1.4 33.02,14.1 31.11,12.19 27.18,12.19 24.32,9.34 21.59,9.34 R21.2 ENC_CONN.1 21.59,4.54 C4.1
N$4  (via drill 0.35)
  Top 0.813: v37.08,47.24 36.83,46.99 v33.27,46.99
  Bottom 0.813: T5.E v37.08,47.24 | v33.27,46.99 33.27,48.26 | 33.27,48.26 T4.E | R4.2 30.92,48.26 33.27,48.26
N$5
  Top 0.813: ENC_CONN.2 19.05,10.16 21.97,13.08 35.56,13.08 IC1.5
  Bottom 0.813: R23.2 19.18,7.75 ENC_CONN.2 19.05,4.5 C5.1
N$6
  Bottom 1.27: L2.1 56.82,30 IC5.2
  Bottom 2.54: L2.1 D9.C
N$7  (via drill 0.4)
  Top 0.813: v19.56,20.07 19.05,19.56 9.14,19.56 7.37,17.78 UART_CONN.2
  Bottom 0.813: v19.56,20.07 26.92,20.07 30.48,16.51 IC1.3
N$8
  Bottom 0.813: IC1.2 27.94,16.51 26.54,17.91 15.75,17.91 13.34,20.32 UART_CONN.3
N$9
  Top 0.813: ENC_CONN.3 16.51,10.16 23.75,17.4 37.21,17.4 38.1,16.51 IC1.6
  Bottom 0.813: C6.1 ENC_CONN.3 R24.2
N$10
  Bottom 2.54: D6.A D7.C 70.48,42.55 80.52,32.51 AC_IN.2
N$11
  Top 2.54: D3.A D8.C 83.26,38.41 AC_IN.1
N$12
  Top 1.27: R5.S LCD_CONN.3
N$14
  Bottom 0.813: T1.C 63.5,4.06 LCD_CONN.16
N$15
  Bottom 1.27: R25.2 60.96,8.03 LCD_CONN.15
N$16
  Bottom 0.813: R15.2 73.94,12.32 T2.B
N$18
  Bottom 0.813: R7.2 25.4,30.48 21.59,26.67 14.86,26.67 | 14.86,26.67 14.1,26.67 12.83,27.94 IC2.7 | R11.1 14.86,26.67
N$19
  Bottom 0.813: T6.B 36.58,40.77 R13.1
N$20
  Bottom 0.813: R11.2 14.79,30.48 IC2.6 11.43,30.48 10.91,31 R12.2
N$22
  Bottom 0.813: T4.B 35.17,46.36 35.69,45.85 | 35.69,45.85 36.83,45.85 | 36.83,45.85 38.1,45.85 38.98,46.73 T5.B | T6.C 35.45,45.85 35.69,45.85 | 36.83,45.85 37.15,45.53 R22.1
N$23
  Bottom 0.813: R17.1 11.82,34 12.7,33.12 IC2.5
N$25
  Bottom 0.813: R10.S R10.E 22.23,37.47 21.59,36.83 R9.2
N$26  (via drill 0.6)
  Top 0.813: R10.A 27.94,38.61 v27.94,32.89
  Bottom 0.813: IC2.2 25.27,32.89 v27.94,32.89 R30.2
N$27  (via drill 0.4)
  Top 0.813: v17.78,27.94 17.78,26.67 19.05,25.4 IC2.1 20.45,25.4 22.48,27.43 29.08,27.43 v29.59,27.94
  Bottom 0.813: R9.1 17.78,36.78 v17.78,27.94 | R6.2 v29.59,27.94
N$28  (via drill 0.4)
  Top 0.813: IC2.3 18.29,30.48 v11.81,36.96
  Bottom 0.813: D5.A 30.66,35.05 24.89,35.05 IC2.3 | v11.81,36.96 11.77,37 R16.1
N$29
  Bottom 0.813: T6.E 33.15,40.51 33.84,39.82 R8.2
N$30  (via drill 0.4)
  Top 0.813: v19.05,15.24 v13.08,15.24
  Bottom 0.813: 11.43,15.24 UART_CONN.1 5.08,14.03 C1.2 | R1.2 12.38,10.48 11.43,11.43 11.43,15.24 | IC1.1 v19.05,15.24 | v13.08,15.24 11.43,15.24
N$31
  Top 2.54: L1.1 16.51,48.26 13.97,50.8 13.97,58.55 11.94,60.58 X1.1
  Bottom 0.813: R16.2 6.35,38.8 6.35,59.69 7.24,60.58 X1.1
N$32
  Top 2.54: Q1.D 30.48,48.01 L1.2 30.23,43.18 D10.C
N$34
  Bottom 0.813: T2.C 78.23,9.06 79.63,7.66 SG2.- 79.63,8.26 81.46,8.26 D4.A
N$35
  Bottom 0.813: R19.2 68.71,5.06 T1.B
N$37
  Bottom 0.813: R14.1 9.14,4.06 D2.A
N$40  (via drill 0.35)
  Top 0.813: X1.2 7.24,55.5 5.08,53.34 5.08,35.24 6.35,33.98 | v7.37,33.85 6.48,33.85 6.35,33.98 | v7.24,28.07 6.35,28.96 6.35,33.98
  Bottom 0.813: v7.37,33.85 8.5,33.85 R17.2 | v7.24,28.07 7.31,28 C8.1
  Bottom 2.54: R18.2 14.09,55.5 X1.2
NTC_SENSE  (via drill 0.4)
  Top 0.813: X1.4 13.08,45.34 15.24,43.18 15.24,40.64 21.59,34.29 22.86,34.29 v27.94,29.21
  Bottom 0.813: R2.1 33.02,20.26 IC1.25 33.02,24.13 31.75,25.4 30.48,25.4 27.94,27.94 v27.94,29.21
PWM_BACKLIGHT  (via drill 0.4)
  Top 0.813: v60.07,14.35 62.23,12.19 66.42,12.19 v68.71,9.91
  Bottom 0.813: v60.07,14.35 60.07,16.76 58.42,18.41 IC1.15 | v68.71,9.91 R19.1
PWM_HEATER  (via drill 0.35)
  Top 0.813: v41.2,39.38 41.65,39.03 44.45,36.83 45.72,35.56 45.72,29.21 49.53,25.4 54.61,25.4 55.88,24.13 IC1.16
  Bottom 0.813: R20.2 39.05,39.37 | 39.05,39.37 R13.2 | v41.2,39.38 41.19,39.37 39.05,39.37
TC_SENSE
  Bottom 0.813: IC1.24 35.56,27.94 R6.1
TILT_SENSE  (via drill 0.4)
  Top 0.813: v25.4,28.83 22.48,31.75 19.05,31.75 12.7,38.1 12.7,39.37 11.81,40.26 X1.5
  Bottom 0.813: R3.1 31.75,17.78 30.48,19.05 IC1.26 25.4,27.94 v25.4,28.83

### Text on the board
tNames: SOLDERING_STATION V1.0